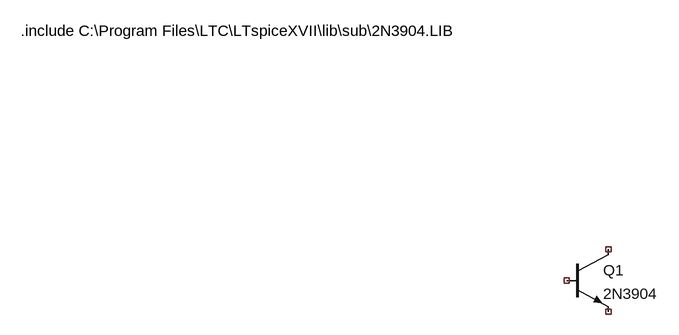
[diagram p0: schematic Draft1.asc]
Draft1.asc, the LTspice schematic file:
Version 4
SHEET 1 1288 680
SYMBOL npn 784 400 R0
SYMATTR InstName Q1
SYMATTR Value 2N3904
TEXT -56 64 Left 2 !.include C:\\Program Files\\LTC\\LTspiceXVII\\lib\\sub\\2N3904.LIB

The netlist it stands for:
* Draft1.asc
Q1 NC_01 NC_02 NC_03 0 2N3904
.model NPN NPN
.model PNP PNP
.lib standard.bjt
.include C:\Program Files\LTC\LTspiceXVII\lib\sub\2N3904.LIB
.backanno
.end